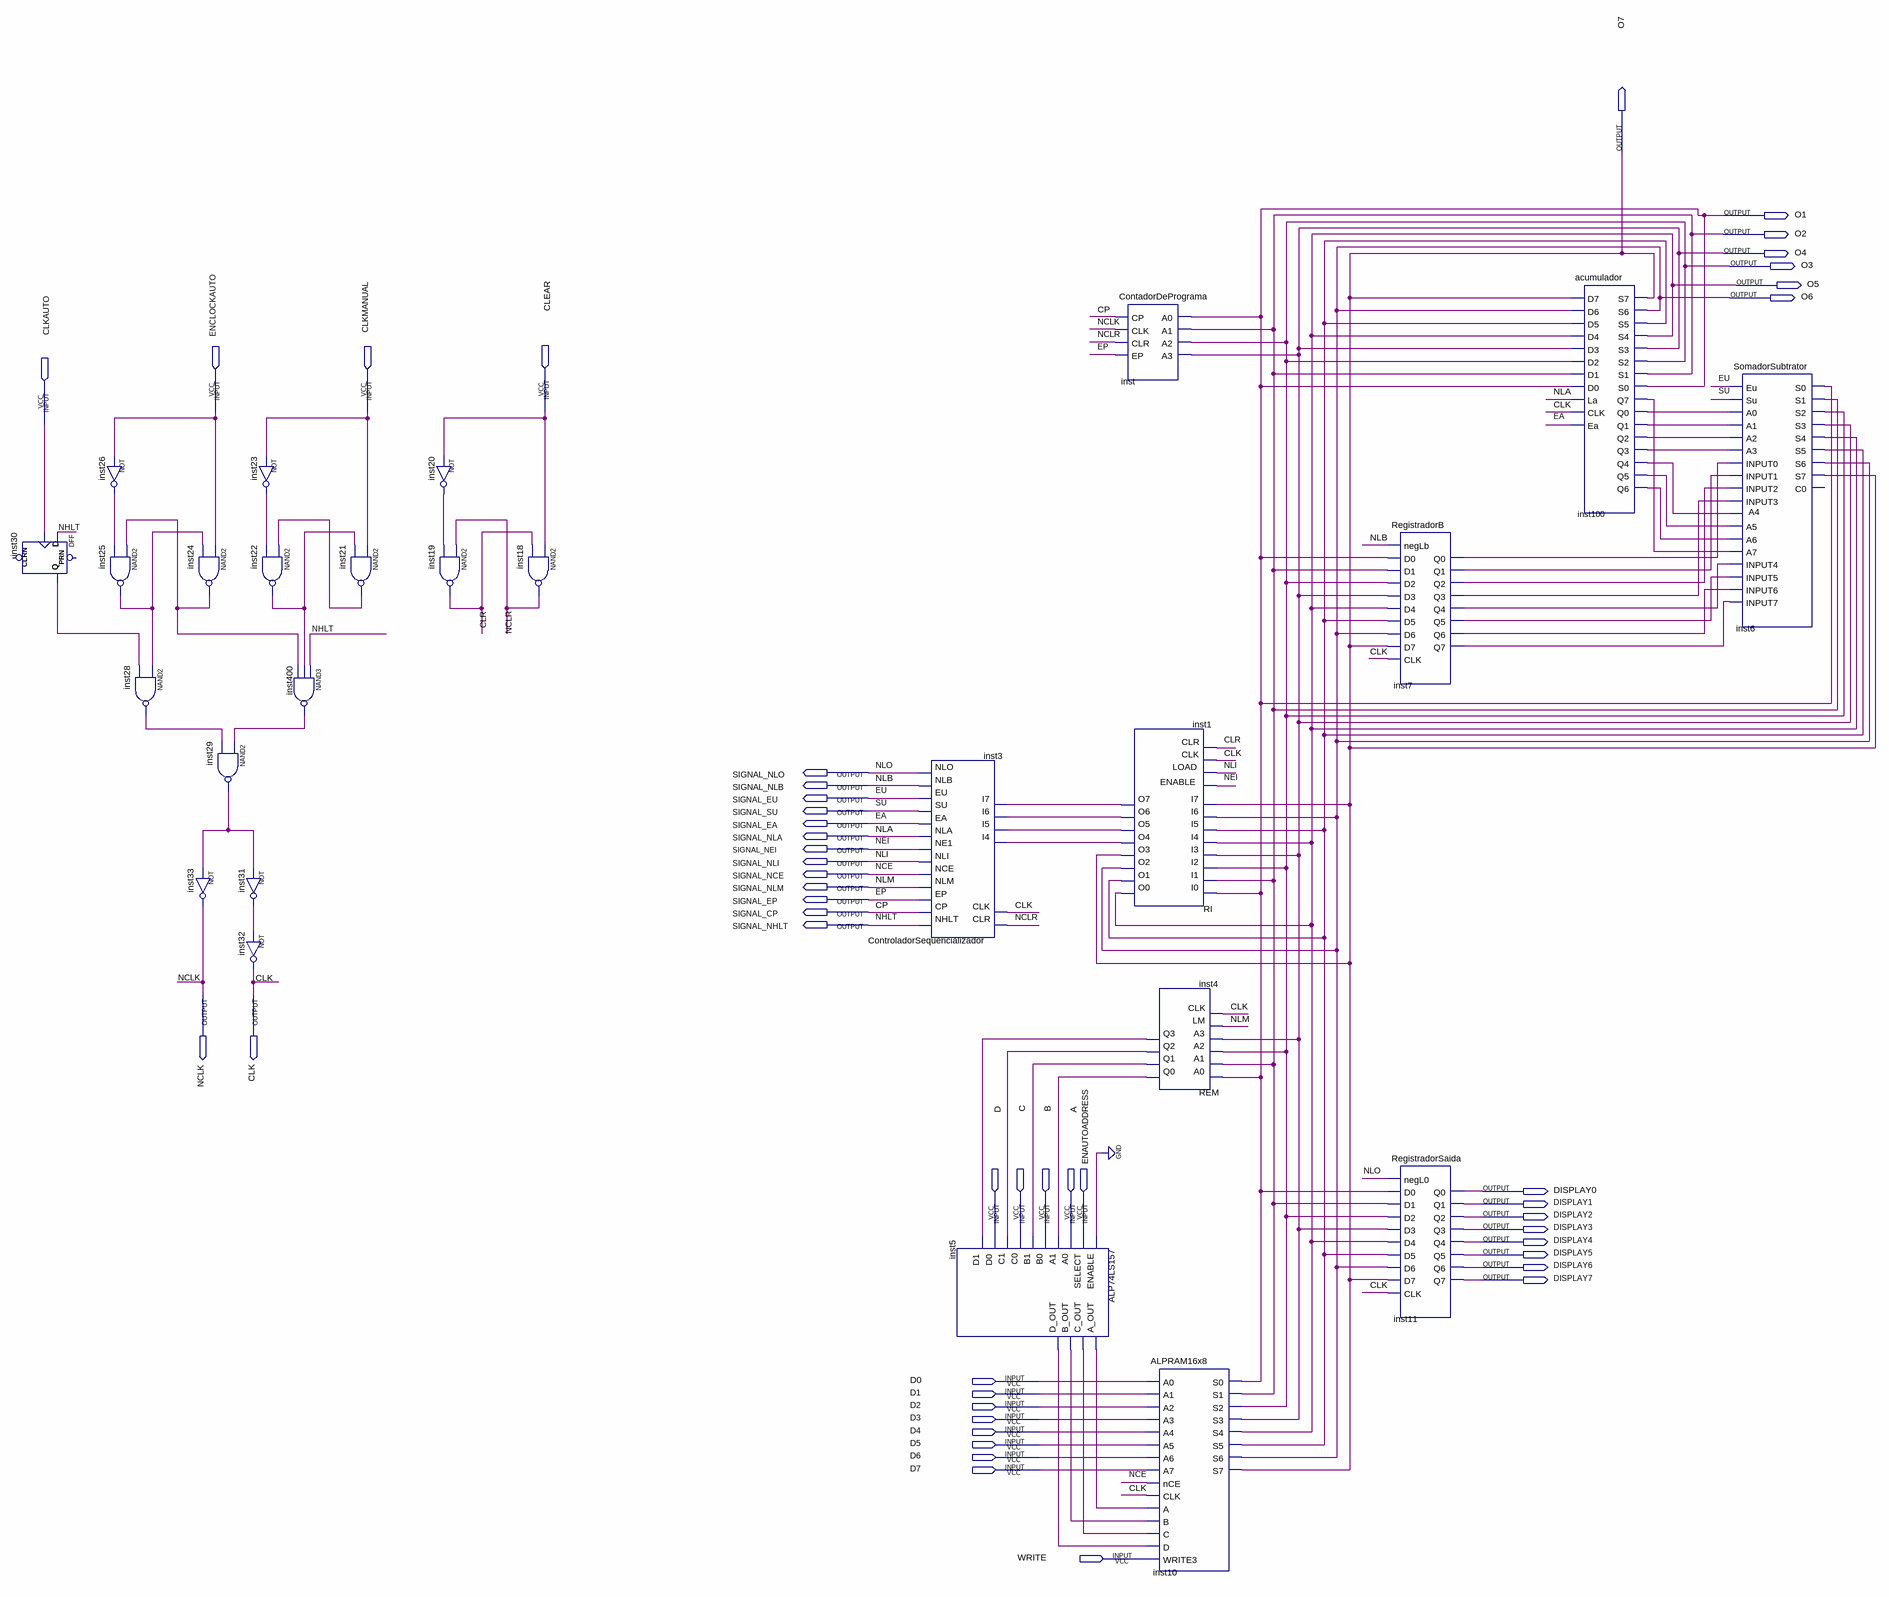
[diagram p0: schematic sheet]
// Quartus schematic SAP1.bdf as structural Verilog: 26 symbols, 48 pins
module SAP1 (
  input  ENCLOCKAUTO,
  input  CLKMANUAL,
  input  CLEAR,
  input  CLKAUTO,
  input  D,
  input  C,
  input  B,
  input  A,
  input  ENAUTOADDRESS,
  input  D0,
  input  D1,
  input  D2,
  input  D3,
  input  D4,
  input  D5,
  input  D6,
  input  D7,
  input  WRITE,
  output O7,
  output O1,
  output O2,
  output O4,
  output O3,
  output O5,
  output O6,
  output SIGNAL_NLO,
  output SIGNAL_NLB,
  output SIGNAL_EU,
  output SIGNAL_SU,
  output SIGNAL_EA,
  output SIGNAL_NLA,
  output SIGNAL_NEI,
  output SIGNAL_NLI,
  output SIGNAL_NCE,
  output SIGNAL_NLM,
  output SIGNAL_EP,
  output SIGNAL_CP,
  output SIGNAL_NHLT,
  output NCLK,
  output CLK,
  output DISPLAY0,
  output DISPLAY1,
  output DISPLAY2,
  output DISPLAY3,
  output DISPLAY4,
  output DISPLAY5,
  output DISPLAY6,
  output DISPLAY7
);

  wire CLR, inst1_o1, inst1_o4, inst1_o5, inst1_o6, inst1_o7, inst4_q0, inst4_q1, inst4_q2, inst4_q3,
       inst5_a_out, inst5_b_out, inst5_c_out, inst5_d_out, inst7_q0, inst7_q1, inst7_q2, inst7_q3, inst7_q4,
       inst7_q5, inst7_q6, inst7_q7, inst20_out, inst21_out, inst22_out, inst23_out, inst24_out, inst25_out,
       inst26_out, inst28_out, inst29_out, inst30_q, inst31_out, inst100_q0, inst100_q1, inst100_q2,
       inst100_q3, inst100_q4, inst100_q5, inst100_q6, inst100_q7, inst400_out, NCLR;

  DFF inst30 (.CLK(CLKAUTO), .D(SIGNAL_NHLT), .Q(inst30_q));  // open: CLRN, PRN
  not inst26 (inst26_out, ENCLOCKAUTO);
  nand inst25 (inst25_out, inst24_out, inst26_out);
  nand inst28 (inst28_out, inst25_out, inst30_q);
  nand inst24 (inst24_out, ENCLOCKAUTO, inst25_out);
  not inst33 (NCLK, inst29_out);
  nand inst29 (inst29_out, inst400_out, inst28_out);
  not inst31 (inst31_out, inst29_out);
  not inst32 (CLK, inst31_out);
  not inst23 (inst23_out, CLKMANUAL);
  nand inst22 (inst22_out, inst21_out, inst23_out);
  nand inst400 (inst400_out, SIGNAL_NHLT, inst22_out, inst24_out);
  nand inst21 (inst21_out, CLKMANUAL, inst22_out);
  not inst20 (inst20_out, CLEAR);
  nand inst19 (CLR, NCLR, inst20_out);
  nand inst18 (NCLR, CLEAR, CLR);
  ControladorSequencializador inst3 (
    .CLR(NCLR), .I7(inst1_o7), .I6(inst1_o6), .I5(inst1_o5), .I4(inst1_o4), .CLK(CLK), .NHLT(SIGNAL_NHLT),
    .CP(SIGNAL_CP), .EP(SIGNAL_EP), .NLM(SIGNAL_NLM), .NCE(SIGNAL_NCE), .NLI(SIGNAL_NLI), .NE1(SIGNAL_NEI),
    .NLA(SIGNAL_NLA), .EA(SIGNAL_EA), .SU(SIGNAL_SU), .EU(SIGNAL_EU), .NLB(SIGNAL_NLB), .NLO(SIGNAL_NLO));
  ALP74LS157 inst5 (
    .ENABLE(1'b0), .SELECT(ENAUTOADDRESS), .A0(A), .A1(inst4_q0), .B0(B), .B1(inst4_q1), .C0(C),
    .C1(inst4_q2), .D0(D), .D1(inst4_q3), .A_OUT(inst5_a_out), .C_OUT(inst5_c_out), .B_OUT(inst5_b_out),
    .D_OUT(inst5_d_out));
  ContadorDePrograma inst (.CP(SIGNAL_CP), .CLK(NCLK), .CLR(NCLR), .EP(SIGNAL_EP), .A0(O1), .A1(O2), .A2(O3), .A3(O4));
  RI inst1 (
    .I0(O1), .I1(O2), .I2(O3), .I3(O4), .LOAD(SIGNAL_NLI), .ENABLE(SIGNAL_NEI), .I4(O5), .I5(inst1_o1),
    .I6(O6), .I7(O7), .CLK(CLK), .CLR(CLR), .O0(O5), .O1(inst1_o1), .O2(O6), .O3(O7), .O4(inst1_o4),
    .O5(inst1_o5), .O6(inst1_o6), .O7(inst1_o7));
  REM inst4 (
    .A0(O1), .A1(O2), .A2(O3), .A3(O4), .LM(SIGNAL_NLM), .CLK(CLK), .Q0(inst4_q0), .Q1(inst4_q1),
    .Q2(inst4_q2), .Q3(inst4_q3));
  ALPRAM16x8 inst10 (
    .A0(D0), .A1(D1), .A2(D2), .A3(D3), .A4(D4), .A5(D5), .A6(D6), .A7(D7), .nCE(SIGNAL_NCE), .CLK(CLK),
    .A(inst5_a_out), .B(inst5_b_out), .C(inst5_c_out), .D(inst5_d_out), .WRITE3(WRITE), .S0(O1), .S1(O2),
    .S2(O3), .S3(O4), .S4(O5), .S5(inst1_o1), .S6(O6), .S7(O7));
  RegistradorB inst7 (
    .negLb(SIGNAL_NLB), .D0(O1), .D1(O2), .D2(O3), .D3(O4), .D4(O5), .D5(inst1_o1), .D6(O6), .D7(O7),
    .CLK(CLK), .Q0(inst7_q0), .Q1(inst7_q1), .Q2(inst7_q2), .Q3(inst7_q3), .Q4(inst7_q4), .Q5(inst7_q5),
    .Q6(inst7_q6), .Q7(inst7_q7));
  RegistradorSaida inst11 (
    .negL0(SIGNAL_NLO), .D0(O1), .D1(O2), .D2(O3), .D3(O4), .D4(O5), .D5(inst1_o1), .D6(O6), .D7(O7),
    .CLK(CLK), .Q0(DISPLAY0), .Q1(DISPLAY1), .Q2(DISPLAY2), .Q3(DISPLAY3), .Q4(DISPLAY4), .Q5(DISPLAY5),
    .Q6(DISPLAY6), .Q7(DISPLAY7));
  acumulador inst100 (
    .D7(O7), .D6(O6), .D5(inst1_o1), .D4(O5), .D3(O4), .D2(O3), .D1(O2), .D0(O1), .La(SIGNAL_NLA), .CLK(CLK),
    .Ea(SIGNAL_EA), .S7(O7), .S6(O6), .S5(inst1_o1), .S4(O5), .S3(O4), .S2(O3), .S1(O2), .S0(O1),
    .Q7(inst100_q7), .Q0(inst100_q0), .Q1(inst100_q1), .Q2(inst100_q2), .Q3(inst100_q3), .Q4(inst100_q4),
    .Q5(inst100_q5), .Q6(inst100_q6));
  SomadorSubtrator inst6 (
    .Eu(SIGNAL_EU), .Su(SIGNAL_SU), .A0(inst100_q0), .A1(inst100_q1), .A2(inst100_q2), .A3(inst100_q3),
    .INPUT0(inst7_q0), .INPUT1(inst7_q1), .INPUT2(inst7_q2), .A4(inst100_q4), .INPUT3(inst7_q3),
    .A5(inst100_q5), .A6(inst100_q6), .A7(inst100_q7), .INPUT4(inst7_q4), .INPUT5(inst7_q5),
    .INPUT6(inst7_q6), .INPUT7(inst7_q7), .S0(O1), .S1(O2), .S2(O3), .S3(O4), .S4(O5), .S5(inst1_o1),
    .S6(O6), .S7(O7));  // open: C0

  // Other names for the same wires on the sheet: CP = SIGNAL_CP; EA = SIGNAL_EA; EP = SIGNAL_EP; EU = SIGNAL_EU;
  //   NCE = SIGNAL_NCE; NEI = SIGNAL_NEI; NHLT = SIGNAL_NHLT; NLA = SIGNAL_NLA; NLB = SIGNAL_NLB; NLI = SIGNAL_NLI;
  //   NLM = SIGNAL_NLM; NLO = SIGNAL_NLO; SU = SIGNAL_SU
endmodule
